# EAGLE design 393det (EAGLE 6.4)
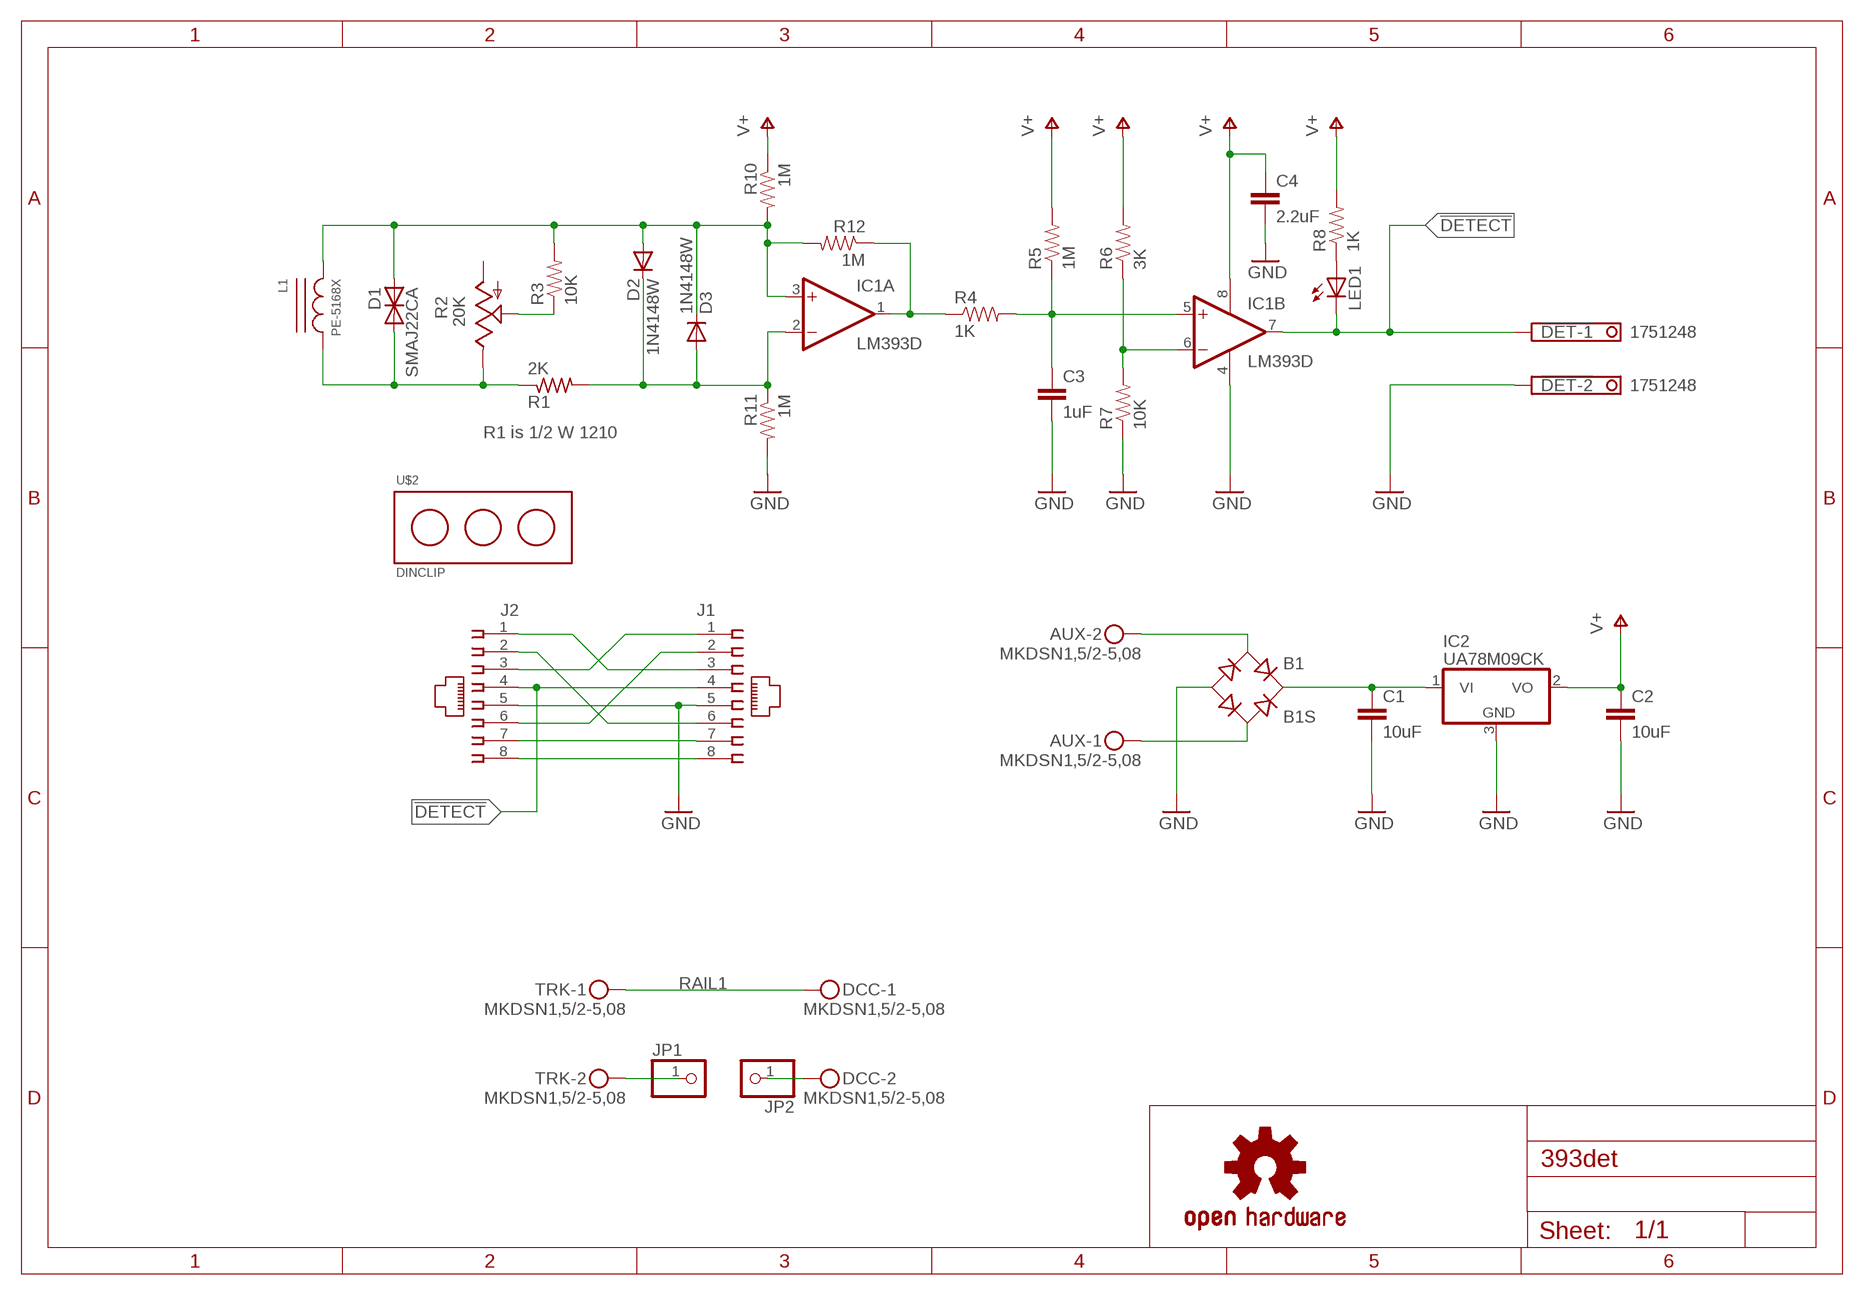
[diagram p0: schematic, sheet 1]

## Parts
!DET  1751248  [1751248]
AUX  MKDSN1,5/2-5,08  [MKDSN1,5/2-5,08]
B1  B1S  [MBS]
C1  10uF  22UF-16V-20%-(1210)  [1210]
C2  10uF  22UF-16V-20%-(1210)  [1210]
C3  1uF  CAP0805  [0805]
C4  2.2uF  CAP0805  [0805]
D1  SMAJ22CA  SMAJ22CA"  [SMA]
D2  1N4148W  DIODE-SOD123  [SOD123]
D3  1N4148W  DIODE-SOD123  [SOD123]
DCC  MKDSN1,5/2-5,08  [MKDSN1,5/2-5,08]
IC1  LM393D  [SO08]
IC2  UA78M09CK  7808DT  [TO252]
J1  215877-7  [215877-7]
J2  215877-7  [215877-7]
JP1  PINHD-1X1  [1X01]
JP2  PINHD-1X1  [1X01]
L1  PE-5168X  [PE-5168X]
LED1  LED5MM  [LED5MM]
R1  2K  R-US_R1206  [R1206]
R2  20K  TRIM_US-B25U  [B25U]
R3  10K  RESISTOR0805-RES  [0805]
R4  1K  RESISTOR0805-RES  [0805]
R5  1M  RESISTOR0805-RES  [0805]
R6  3K  RESISTOR0805-RES  [0805]
R7  10K  RESISTOR0805-RES  [0805]
R8  1K  RESISTOR0805-RES  [0805]
R10  1M  RESISTOR0805-RES  [0805]
R11  1M  RESISTOR0805-RES  [0805]
R12  1M  RESISTOR0805-RES  [0805]
TRK  MKDSN1,5/2-5,08  [MKDSN1,5/2-5,08]
U$1  OSHW-LOGOM  [OSHW-LOGO-M]
U$2  DINCLIP  [1201578]

## Nets
!DETECT: !DET.1 IC1.7(B:OUT) J1.4 J2.4 LED1.K(C)
GND: !DET.2 B1.- C1.2 C2.2 C3.2 C4.2 IC1.4(P:V-) IC2.3(GND) J1.5 J2.5 R7.1 R11.2
N$1: D1.A D2.A D3.C IC1.3(A:+IN) L1.P$2 R3.2 R10.2 R12.2
N$2: C3.1 IC1.5(B:+IN) R4.2 R5.1
N$3: D2.C D3.A IC1.2(A:-IN) R1.2 R11.1
N$4: D1.C L1.P$1 R1.1 R2.E
N$5: R2.S R3.1
N$6: LED1.A R8.1
N$7: AUX.2 B1.AC1
N$8: AUX.1 B1.AC2
N$9: J1.8 J2.8
N$10: JP1.1 TRK.2
N$11: DCC.2 JP2.1
N$12: J1.7 J2.7
N$13: IC1.1(A:OUT) R4.1 R12.1
N$14: IC1.6(B:-IN) R6.1 R7.2
N$15: J1.3 J2.1
N$16: J1.1 J2.3
N$17: J1.6 J2.2
N$18: J1.2 J2.6
N$20: B1.+ C1.1 IC2.1(VI)
RAIL1: DCC.1 TRK.1
V+: C2.1 C4.1 IC1.8(P:V+) IC2.2(VO) R5.2 R6.2 R8.2 R10.1
Unconnected: R2.A

## Notes on the sheet
- R1 is 1/2 W 1210

## Library data of the parts
!DET = con-phoenix-350:1751248: MKDS 1/ 2-3,5 Printklemme Nennstrom: 10 A Bemessungsspannung: 160 V Raster: 3,5 mm Polzahl: 2 Montageart: Löten Anschlussart: Schraubanschluss Anschlussrichtung vom Leiter zur Platine: 0° Source: http://eshop.phoenixcontact.com .. 1751248.pdf; OC_FARNELL: unknown; OC_NEWARK: unknown
AUX DCC TRK = con-phoenix-508:MKDSN1,5/2-5,08: MKDSN 1,5/ 2-5,08 Printklemme Nennstrom: 13,5 A Nennspannung: 250 V Rastermaß: 5,08 mm Polzahl: 2 Anschlussart: Schraubanschluss Montage: Löten Anschlussrichtung Leiter/Platine: 0 ° Artikelnummer: 1729128 Source: http://eshop.phoenixcontact.com .. 1729128.pdf; MPN: MKDSN 1,5/2-5.08; OC_FARNELL: 1792903; OC_NEWARK: 30M2397
B1 = rectifier:B*S: Surface Mount Glass Passivated Bridge Rectifiers Source: Comchip Bridge Rectifiers B05S-G_B10S-G.pdf
C1 C2 = SparkFun-Capacitors:22UF-16V-20%-(1210): CAP-10381; PROD_ID: CAP-10381; VALUE: 22uF
C3 C4 = SparkFun-Capacitors:CAP: Capacitor Standard 0603 ceramic capacitor, and 0.1" leaded capacitor.
D1 = sma-tvs:SMAJ22CA
D2 D3 = diode:DIODE-: DIODE
IC1 = linear:LM393: COMPARATOR
IC2 = linear:78*: Positive VOLTAGE REGULATOR Source: http://cache.national.com/ds/LM/LM78L05.pdf http://www.fairchildsemi.com/ds/LM/LM7805.pdf
J1 J2 = con-amp:215877-7: AMP connector; OC_FARNELL: unknown; OC_NEWARK: unknown
JP1 JP2 = pinhead:PINHD-1X1: PIN HEADER
L1 = pe-5168x:PE-5168X: PE-5168X Current Sense Inductor
LED1 = led:LED: LED OSRAM: - CHIPLED LG R971, LG N971, LY N971, LG Q971, LY Q971, LO R971, LY R971 LH N974, LH R974 LS Q976, LO Q976, LY Q976 LO Q996 - Hyper CHIPLED LW Q18S LB Q993, LB Q99A, LB R99A - SideLED LS A670, LO A670, LY A670, LG A670, LP A670 LB A673, LV A673, LT A673, LW A673 LH A674 LY A675 LS A676, LA A676, LO A676, LY A676, LW A676 LS A679, LY A679, LG A679 - Hyper Micro SIDELED® LS Y876, LA Y876, LO Y876, LY Y876 LT Y87S - SmartLED LW L88C, LW L88S LB L89C, LB L89S, LG L890 LS L89K, LO L89K, LY L89K LS L896, LA L896, LO L896, LY L896 - TOPLED LS T670, LO T670, LY T670, LG T670, LP T670 LSG T670, LSP T670, LSY T670, LOP T670, LYG T670 LG T671, LOG T671, LSG T671 LB T673, LV T673, LT T673, LW T673 LH T674 LS T676, LA T676, LO T676, LY T676, LB T676, LH T676, LSB T676, LW T676 LB T67C, LV T67C, LT T67C, LS T67K, LO T67K, LY T67K, LW E67C LS E67B, LA E67B, LO E67B, LY E67B, LB E67C, LV E67C, LT E67C LW T67C LS T679, LY T679, LG T679 LS T770, LO T770, LY T770, LG T770, LP T770 LB T773, LV T773, LT T773, LW T773 LH T774 LS E675, LA E675, LY E675, LS T675 LS T776, LA T776, LO T776, LY T776, LB T776 LHGB T686 LT T68C, LB T68C - Hyper Mini TOPLED® LB M676 - Mini TOPLED Santana® LG M470 LS M47K, LO M47K, LY M47K Source: http://www.osram.convergy.de LUXEON: - LUMILED® LXK2-PW12-R00, LXK2-PW12-S00, LXK2-PW14-U00, LXK2-PW14-V00 LXK2-PM12-R00, LXK2-PM12-S00, LXK2-PM14-U00 LXK2-PE12-Q00, LXK2-PE12-R00, LXK2-PE12-S00, LXK2-PE14-T00, LXK2-PE14-U00 LXK2-PB12-K00, LXK2-PB12-L00, LXK2-PB12-M00, LXK2-PB14-N00, LXK2-PB14-P00, LXK2-PB14-Q00 LXK2-PR12-L00, LXK2-PR12-M00, LXK2-PR14-Q00, LXK2-PR14-R00 LXK2-PD12-Q00, LXK2-PD12-R00, LXK2-PD12-S00 LXK2-PH12-R00, LXK2-PH12-S00 LXK2-PL12-P00, LXK2-PL12-Q00, LXK2-PL12-R00 Source: www.luxeon.com KINGBRIGHT: KA-3528ASYC Source: www.kingbright.com
R1 = rcl:R-US_: RESISTOR, American symbol
R2 = pot:TRIM_US-: POTENTIOMETER
R3-R8 R10-R12 = SparkFun:RESISTOR: Resistor Basic schematic elements and footprints for 0603, 1206, and PTH resistors.
U$1 = SparkFun:OSHW-LOGO: Open Source Hardware Logo This logo indicates the piece of hardware it is found on incorporates a OSHW license and/or adheres to the definition of open source hardware found here: http://freedomdefined.org/OSHW
U$2 = dinrail-clip:DINCLIP

## Board
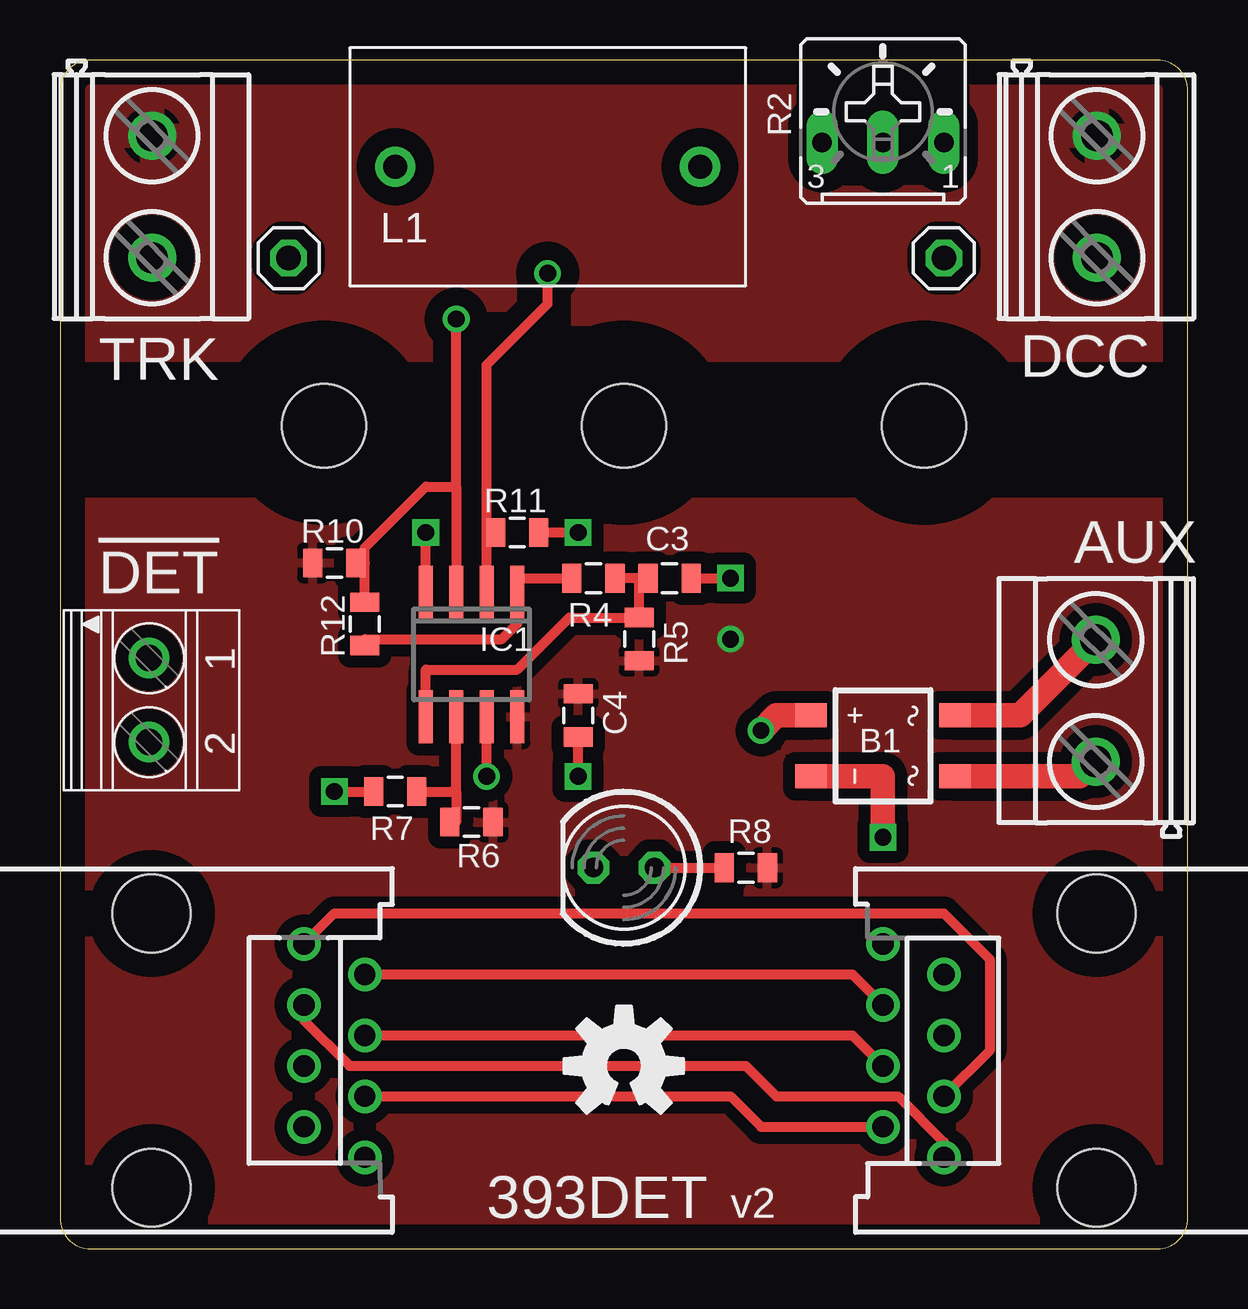
[diagram p1: board, top side]
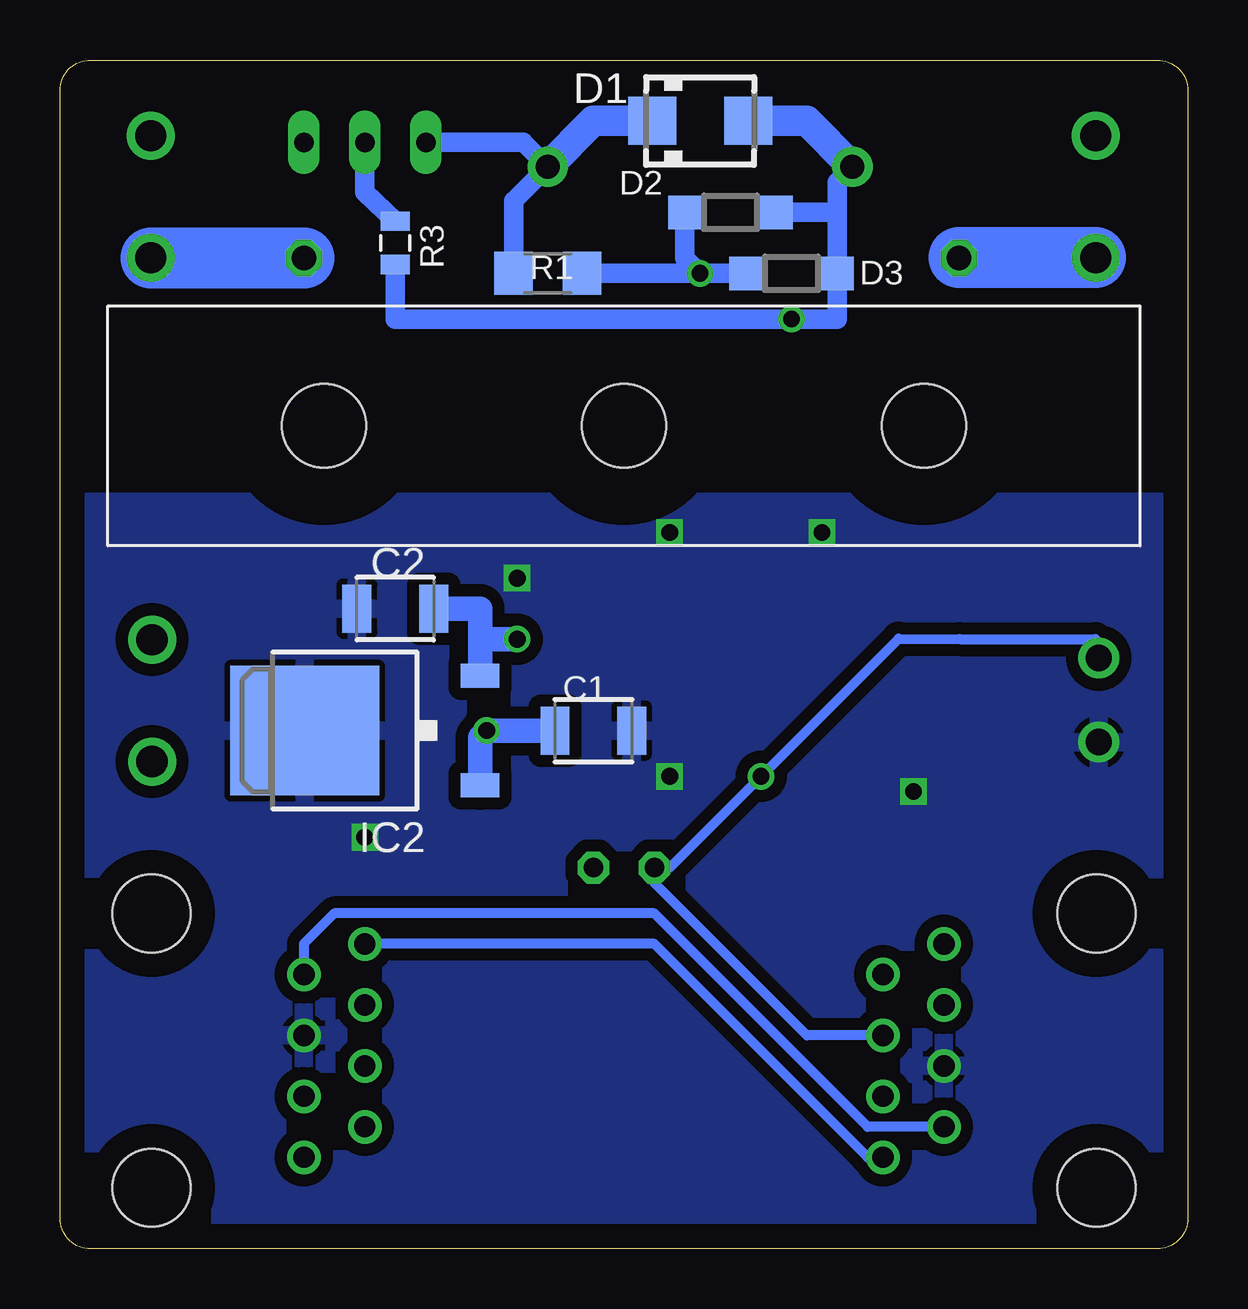
[diagram p2: board, bottom side, seen from below]

Size 46.99 x 49.53 mm. Coordinates in mm from the lower left corner, seen from the top.
Outline: 0,1.27 arc90 1.27,0 45.72,0 arc90 46.99,1.27 46.99,48.26 arc90 45.72,49.53 1.27,49.53 arc90 0,48.26 0,1.27
Copper layers (1*16): Top 0.035mm / dielectric 1.5mm / Bottom 0.035mm
Design rules "default": minimum track width 10mil, minimum drill 24mil, track to track 8mil, track to pad 8mil, pad to pad 8mil, via to via 8mil, smd to smd 8mil, copper to edge 40mil, drill to drill 8mil, minimum pad ring 10mil, minimum via ring 8mil, stop-mask expansion 4mil, vias tented up to drill 0mil, thermal gap 10mil

### Footprints (pad centres in the part's own frame; a part is rotated, then mirrored left to right if it is on the bottom)
1751248 = drill 1.1 pad 1.7: 1 -1.75,-0.1; 2 1.75,-0.1
MKDSN1,5/2-5,08 = drill 1.3 pad 2: 1 -2.561,0.025; 2 2.519,0.025
MBS = smd 1 x 1.3: + -1.27,-3; - 1.27,-3; AC1 -1.27,3; AC2 1.27,3
1210 = smd 1.2 x 2: 1 -1.6,0; 2 1.6,0
0805 = smd 0.8 x 1.2: 1 -0.9,0; 2 0.9,0
SMA = smd 2 x 2: A 2,0; C -2,0
SOD123 = smd 1.4 x 1.4: A 1.9,0; C -1.9,0
SO08 = smd 0.6 x 2.2: 1 -1.905,-2.6; 2 -0.635,-2.6; 3 0.635,-2.6; 4 1.905,-2.6; 5 1.905,2.6; 6 0.635,2.6; 7 -0.635,2.6; 8 -1.905,2.6
TO252 = smd 1 x 1.6: 1 -2.28,-4.8; 2 2.28,-4.8 | smd 5.4 x 6.2: 3 0,2.5
215877-7 = drill 0.889: 1 -4.445,6.35; 2 -3.175,8.89; 3 -1.905,6.35; 4 -0.635,8.89; 5 0.635,6.35; 6 1.905,8.89; 7 3.175,6.35; 8 4.445,8.89 | hole 3.251: -5.715,0; 5.715,0
1X01 = drill 1.016 octagon: 1 0,0
PE-5168X = drill 1 pad 1.676: P$1 0,0; P$2 12.7,0
LED5MM = drill 0.813 octagon: A -1.27,0; K 1.27,0
R1206 = smd 1.6 x 1.803: 1 -1.422,0; 2 1.422,0
B25U = drill 0.813 long: A 2.54,-0.889; E -2.54,-0.889; S 0,-0.889
1201578 = hole 3.5: 0,0; 12.5,0; -12.5,0

### Placement (x,y rotation side)
!DET  3.81,22.86 270 top
AUX  43.18,22.86 90 top
B1  34.29,20.95 270 top
C1  24.77,21.59 0 bottom
C2  33.02,26.67 180 bottom
C3  25.4,27.94 0 top
C4  21.59,22.23 270 top
D1  20.32,46.99 0 bottom
D2  19.05,43.18 0 bottom
D3  16.51,40.64 180 bottom
DCC  43.18,43.81 270 top
IC1  17.14,24.77 180 top
IC2  34.29,21.59 90 bottom
J1  43.18,8.26 90 top
J2  3.81,8.26 270 top
JP1  9.53,41.27 270 top
JP2  36.83,41.27 270 top
L1  26.67,45.09 180 top
LED1  23.5,15.88 180 top
R1  26.67,40.64 0 bottom
R2  34.29,46.99 0 top
R3  33.02,41.91 270 bottom
R4  22.23,27.94 0 top
R5  24.13,25.4 270 top
R6  17.14,17.78 0 top
R7  13.97,19.05 0 top
R8  28.57,15.88 0 top
R10  11.43,28.57 0 top
R11  19.05,29.84 0 top
R12  12.7,26.04 90 top
TRK  3.81,43.81 270 top
U$1  23.5,7.62 0 top
U$2  23.5,34.29 0 top

### Tracks (layer width: path | path; a pad name or v marks a point on that pad's centre or on a via)
!DETECT  (via drill 0.7)
  Top 0.406: J2.4 33.02,8.89 J1.4 | v17.78,19.68 IC1.7
  Bottom 0.406: J2.4 15.88,8.89 22.23,15.24 LED1.K 21.59,15.88 v17.78,19.68 12.04,25.42 9.5,25.4 3.83,25.4 !DET.1
GND  (via drill 0.7)
  Top 0.406: v21.59,19.68 C4.2 | v11.43,19.05 R7.1 | C3.2 v27.94,27.94 | IC1.4 v15.24,29.84 | R11.2 v21.59,29.84
  Top 1.016: B1.- 34.29,19.68 v34.29,17.14
  pour Bottom (isolate 0.508): 0,0 0,31.11 46.99,31.11 46.99,0
N$1  (via drill 0.7)
  Top 0.406: 16.51,31.75 IC1.3 | 16.51,31.75 v16.51,38.73 | R12.2 12.7,28.57 | 12.7,28.57 12.7,29.21 15.24,31.75 16.51,31.75 | 12.7,28.57 R10.2
  Bottom 0.813: R3.2 33.02,38.73 v16.51,38.73 14.61,38.73 D3.C 14.61,43.18 | 14.61,43.18 14.61,44.45 L1.P$2 | 14.61,43.18 D2.A
  Bottom 1.27: D1.A 15.88,46.99 L1.P$2
N$2
  Top 0.406: 24.13,27.94 R4.2 | 24.13,27.94 C3.1 | 24.13,27.94 R5.1 21.22,26.3 19.05,24.13 15.24,24.13 IC1.5
N$3  (via drill 0.7)
  Top 0.406: IC1.2 17.78,29.84 | 17.78,29.84 17.78,36.83 20.32,39.37 v20.32,40.64 | 17.78,29.84 R11.1
  Bottom 0.813: v20.32,40.64 R1.2 | v20.32,40.64 D3.A | D2.C 20.95,41.27 v20.32,40.64
N$4
  Bottom 0.813: R2.E 27.69,46.1 L1.P$1 28.09,43.66 R1.1
  Bottom 1.27: D1.C 24.77,46.99 L1.P$1
N$5
  Bottom 0.813: R3.1 34.29,44.03 R2.S
N$6
  Top 0.406: LED1.A R8.1
N$7
  Top 1.016: B1.AC1 40,22.23 AUX.2
N$8
  Top 1.016: B1.AC2 42.5,19.68 AUX.1
N$9
  Bottom 0.406: J2.8 13.34,3.81 22.23,12.7 J1.8
N$10
  Bottom 1.27: 9.53,41.3 JP1.1
  Bottom 2.54: TRK.2 9.53,41.3
N$11
  Bottom 1.27: 43.2,41.27 DCC.2
  Bottom 2.54: JP2.1 43.2,41.27
N$12
  Bottom 0.406: J2.7 13.34,5.08 22.23,13.97 35.56,13.97 36.83,12.7 J1.7
N$13
  Top 0.406: R4.1 19.05,27.94 IC1.1 19.05,26.04 18.41,25.4 12.7,25.4 R12.1
N$14
  Top 0.406: R6.1 16.51,17.78 16.51,19.05 | 16.51,19.05 IC1.6 | R7.2 16.51,19.05
N$15
  Top 0.406: J1.3 38.73,8.26 38.73,12.06 36.83,13.97 11.43,13.97 J2.1
N$16
  Top 0.406: J1.1 36.83,4.45 34.92,6.35 29.84,6.35 28.57,7.62 12.06,7.62 10.16,9.53 J2.3
N$17
  Top 0.406: J2.2 33.02,11.43 J1.6
N$18
  Top 0.406: J1.2 29.21,5.08 27.94,6.35 J2.6
N$20  (via drill 0.7)
  Top 1.016: B1.+ 29.84,22.23 v29.21,21.59
  Bottom 1.016: IC2.1 29.49,21.31 v29.21,21.59 C1.1
RAIL1
  pour Top (isolate 0.762): 0,37.47 0,49.53 46.99,49.53 46.99,37.47
V+  (via drill 0.7)
  Bottom 1.016: IC2.2 29.49,25.4 | 29.49,25.4 29.49,26.67 C2.1 | 29.49,25.4 v27.94,25.4
  pour Top (isolate 0.508): 0,31.11 46.99,31.11 46.99,0 0,0

### Text on the board
tPlace: 393DET | v2